# EAGLE design FrontDoorController (EAGLE 6.6.0)
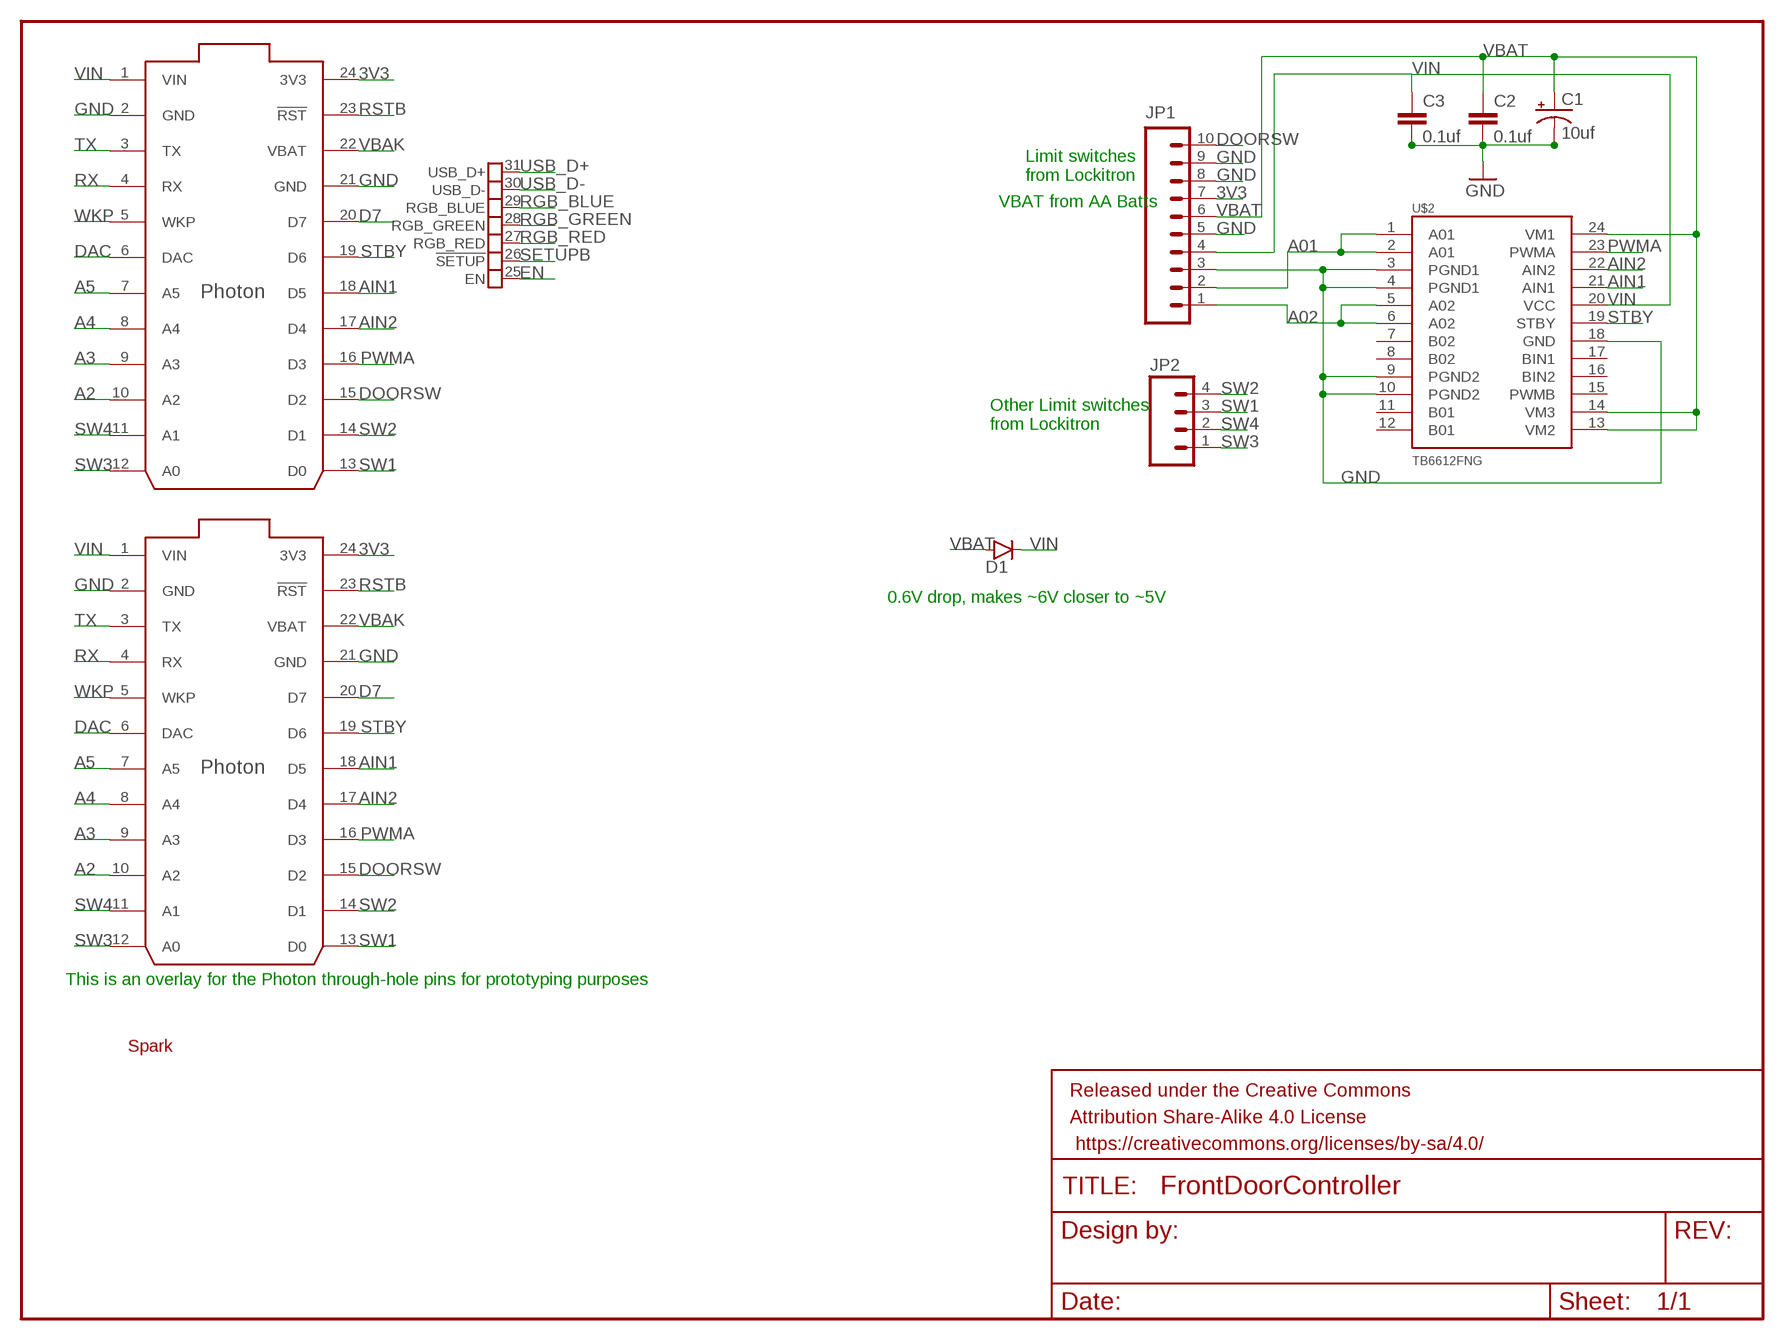
[diagram p0: schematic, sheet 1]

## Parts
C1  10uf  CAP_POL3528  [EIA3528]
C2  0.1uf  CAP0402-CAP  [0402-CAP]
C3  0.1uf  CAP0402-CAP  [0402-CAP]
D1  DIODEPTH  [DIODE-1N4001]
FRAME1  FRAME-LETTER  [CREATIVE_COMMONS]
JP1  M10LOCK  [1X10_LOCK]
JP2  M04LOCK  [1X04_LOCK]
PHOTON  PHOTON_SMD  [PHOTON_SMD]
U$1  SPARK_LOGOLARGE  [SPARK_LOGO]
U$2  TB6612FNG  [SSOP24]
U$3  PHOTON_WITH_HEADERS  [PHOTON]

## Nets
3V3: JP1.7 PHOTON.24(3V3) U$3.24(3V3)
A01: JP1.2 U$2.1(A01) U$2.2(A01)
A2: PHOTON.10(A2) U$3.10(A2)
A02: JP1.1 U$2.5(A02) U$2.6(A02)
A3: PHOTON.9(A3) U$3.9(A3)
A4: PHOTON.8(A4) U$3.8(A4)
A5: PHOTON.7(A5) U$3.7(A5)
AIN1: PHOTON.18(D5) U$2.21(AIN1) U$3.18(D5)
AIN2: PHOTON.17(D4) U$2.22(AIN2) U$3.17(D4)
D7: PHOTON.20(D7) U$3.20(D7)
DAC: PHOTON.6(DAC) U$3.6(DAC)
DOORSW: JP1.10 PHOTON.15(D2) U$3.15(D2)
EN: PHOTON.25(EN)
GND: C1.C(-) C2.2 C3.2 JP1.3 JP1.5 JP1.8 JP1.9 PHOTON.2(GND) PHOTON.21(GND) U$2.3(PGND1) U$2.4(PGND1) U$2.9(PGND2) U$2.10(PGND2) U$2.18(GND) U$3.2(GND) U$3.21(GND)
PWMA: PHOTON.16(D3) U$2.23(PWMA) U$3.16(D3)
RGB_BLUE: PHOTON.29(RGB_BLUE)
RGB_GREEN: PHOTON.28(RGB_GREEN)
RGB_RED: PHOTON.27(RGB_RED)
RSTB: PHOTON.23(!RST) U$3.23(!RST)
RX: PHOTON.4(RX) U$3.4(RX)
SETUPB: PHOTON.26(!SETUP)
STBY: PHOTON.19(D6) U$2.19(STBY) U$3.19(D6)
SW1: JP2.3 PHOTON.13(D0) U$3.13(D0)
SW2: JP2.4 PHOTON.14(D1) U$3.14(D1)
SW3: JP2.1 PHOTON.12(A0) U$3.12(A0)
SW4: JP2.2 PHOTON.11(A1) U$3.11(A1)
TX: PHOTON.3(TX) U$3.3(TX)
USB_D+: PHOTON.31(USB_D+)
USB_D-: PHOTON.30(USB_D-)
VBAK: PHOTON.22(VBAT) U$3.22(VBAT)
VBAT: C1.A(+) C2.1 D1.A JP1.6 U$2.13(VM2) U$2.14(VM3) U$2.24(VM1)
VIN: C3.1 D1.C JP1.4 PHOTON.1(VIN) U$2.20(VCC) U$3.1(VIN)
WKP: PHOTON.5(WKP) U$3.5(WKP)
Unconnected: U$2.7(B02) U$2.8(B02) U$2.11(B01) U$2.12(B01) U$2.15(PWMB) U$2.16(BIN2) U$2.17(BIN1)

## Notes on the sheet
- Limit switches
  from Lockitron
- VBAT from AA Batts
- Other Limit switches
  from Lockitron
- 0.6V drop, makes ~6V closer to ~5V
- This is an overlay for the Photon through-hole pins for prototyping purposes

## Library data of the parts
C1 = SparkFun-Capacitors:CAP_POL: Capacitor Polarized These are standard SMD and PTH capacitors. Normally 10uF, 47uF, and 100uF in electrolytic and tantalum varieties. Always verify the external diameter of the through hole cap, it varies with capacity, voltage, and manufacturer. The EIA devices should be standard.
C2 C3 = SparkFun-Capacitors:CAP: Capacitor Standard 0603 ceramic capacitor, and 0.1" leaded capacitor.
D1 = SparkFun-DiscreteSemi:DIODE: Diode These are standard reverse protection diodes and small signal diodes. SMA package can handle up to about 1A. SOD-323 can handle about 200mA. What the SOD-323 package when ordering, there are some mfgs out there that are 5-pin packages.
FRAME1 = SparkFun-Aesthetics:FRAME-LETTER: Schematic Frame Standard 8.5x11 US Letter frame
JP1 = SparkFun-Connectors:M10: Header 10 Standard 10-pin 0.1" header. Use with straight break away headers (SKU : PRT-00116), right angle break away headers (PRT-00553), swiss pins (PRT-00743), machine pins (PRT-00117), and female headers (PRT-00115).
JP2 = SparkFun-Connectors:M04: Header 4 Standard 4-pin 0.1" header. Use with straight break away headers (SKU : PRT-00116), right angle break away headers (PRT-00553), swiss pins (PRT-00743), machine pins (PRT-00117), and female headers (PRT-00115). Molex polarized connector foot print use with SKU : PRT-08231 with associated crimp pins and housings. 1MM SMD Version SKU: PRT-10208
PHOTON = Spark:PHOTON_SMD: Photon (without headers) - designed to be surface mounted with 7 extra exposed pads on the bottom of the board which include, 3 RGB LED outputs, /SETUP, EN (3.3V SMPS enable input), USB D+ and USB D-.
U$1 = Mikes-Stuff:SPARK_LOGO
U$2 = SparkFun-PowerIC:TB6612FNG: Toshiba 1A dual motor driver IC-09363; PROD_ID: IC-09363
U$3 = Mikes-Stuff:PHOTON

## Board
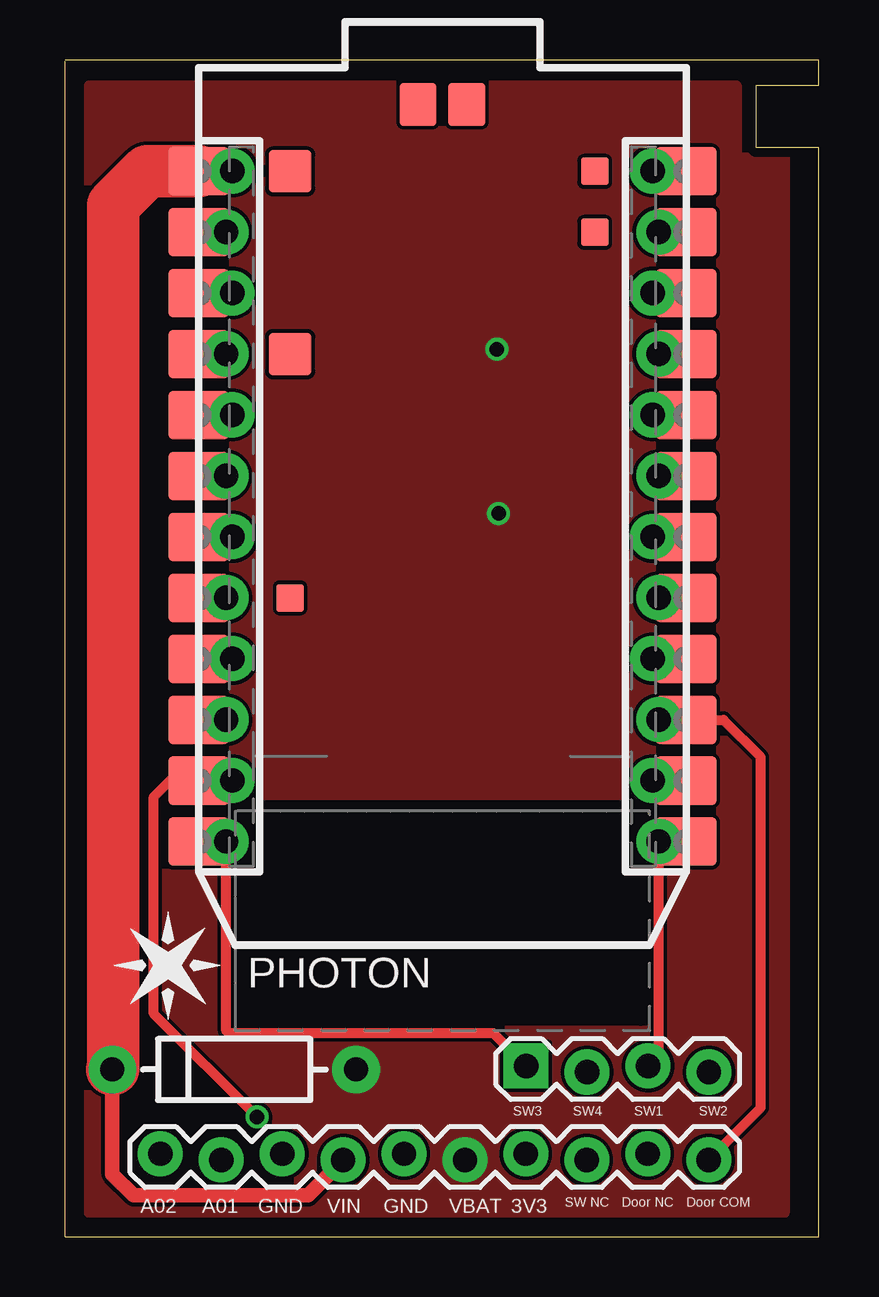
[diagram p1: board, top side]
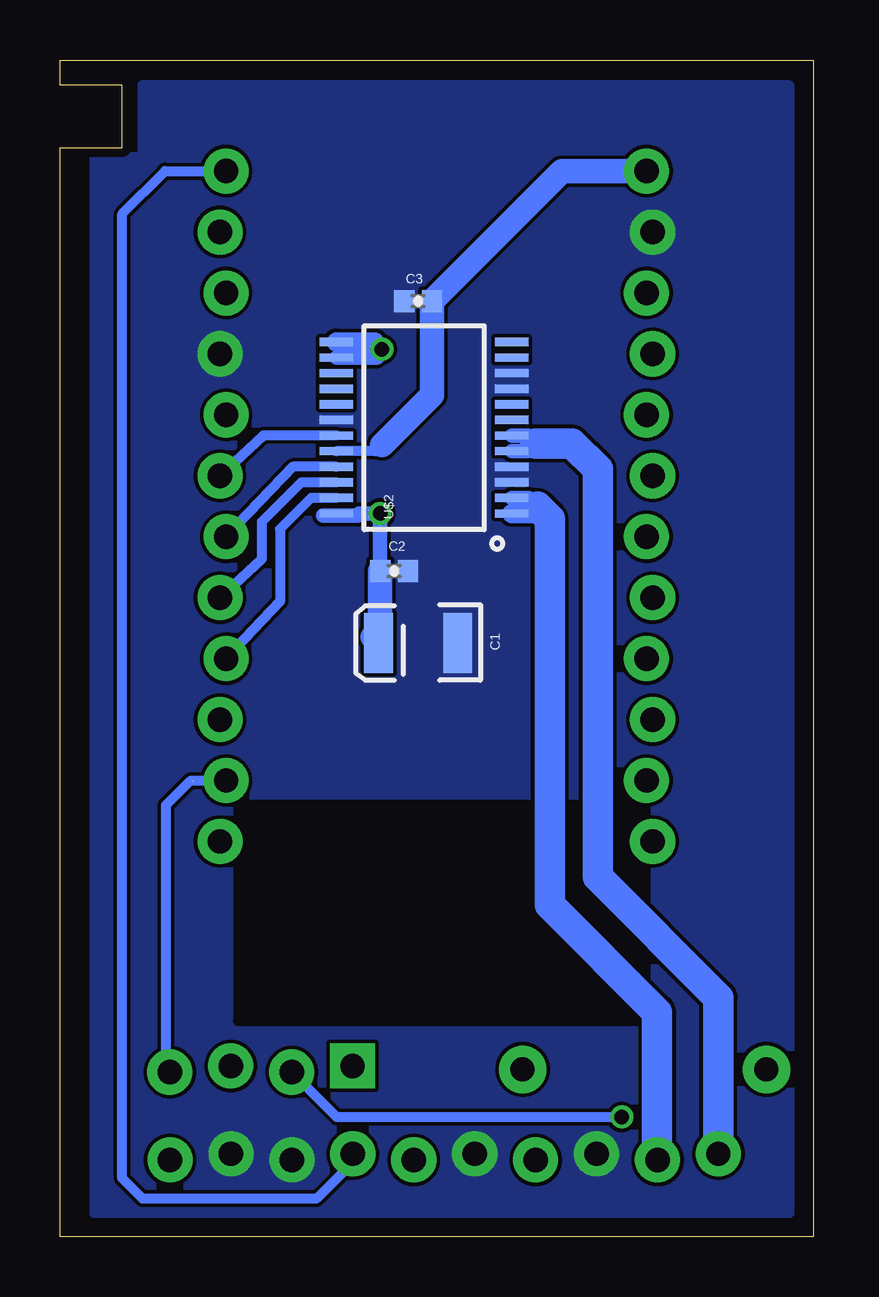
[diagram p2: board, bottom side, seen from below]

Size 31.42 x 49.06 mm. Coordinates in mm from the lower left corner, seen from the top.
Outline: 31.42,49.05 31.42,48 28.82,48 28.82,45.4 31.42,45.4 31.42,0 0,0 0,49
Outline: 31.42,49.05 31.42,49.06
Outline: 31.42,49.05 0,49.06
Copper layers (1*16): Top 0.0356mm / dielectric 1.5011mm / Bottom 0.0356mm
Design rules "LaenPCBOrder": minimum track width 6mil, minimum drill 13mil, track to track 6mil, track to pad 6mil, pad to pad 6mil, via to via 6mil, smd to smd 6mil, copper to edge 15mil, drill to drill 6mil, minimum pad ring 7mil, minimum via ring 7mil, stop-mask expansion 3mil, vias tented up to drill 0mil, thermal gap 10mil

### Footprints (pad centres in the part's own frame; a part is rotated, then mirrored left to right if it is on the bottom)
EIA3528 = smd 1.2 x 2.5: A 1.65,0; C -1.65,0
0402-CAP = smd 0.85 x 0.9: 1 -0.58,0; 2 0.58,0
DIODE-1N4001 = drill 1 pad 1.981: A -5.08,0; C 5.08,0
1X10_LOCK = drill 1.016 pad 1.88: 1 0,0.127; 2 2.54,-0.127; 3 5.08,0.127; 4 7.62,-0.127; 5 10.16,0.127; 6 12.7,-0.127; 7 15.24,0.127; 8 17.78,-0.127; 9 20.32,0.127; 10 22.86,-0.127
1X04_LOCK = drill 1.016 pad 1.88 square: 1 0,0.127 | drill 1.016 pad 1.88: 2 2.54,-0.127; 3 5.08,0.127; 4 7.62,-0.127
PHOTON_SMD = smd 2.54 x 2.032: 1 0,32.258; 2 0,29.718; 3 0,27.178; 4 0,24.638; 5 0,22.098; 6 0,19.558; 7 0,17.018; 8 0,14.478; 9 0,11.938; 10 0,9.398; 11 0,6.858; 12 0,4.318; 13 20.32,4.318; 14 20.32,6.858; 15 20.32,9.398; 16 20.32,11.938; 17 20.32,14.478; 18 20.32,17.018; 19 20.32,19.558; 20 20.32,22.098; 21 20.32,24.638; 22 20.32,27.178; 23 20.32,29.718; 24 20.32,32.258 | smd 1.778 x 1.778: 25 3.81,32.258; 26 3.81,24.638 | smd 1.143 x 1.143: 27 3.81,14.478; 28 16.51,29.718; 29 16.51,32.258 | smd 1.524 x 1.778: 30 11.176,35.052; 31 9.144,35.052
SSOP24 = smd 0.348 x 1.397: 1 -3.575,-3.656; 2 -2.925,-3.656; 3 -2.275,-3.656; 4 -1.625,-3.656; 5 -0.975,-3.656; 6 -0.325,-3.656; 7 0.325,-3.656; 8 0.975,-3.656; 9 1.625,-3.656; 10 2.275,-3.656; 11 2.925,-3.656; 12 3.575,-3.656; 13 3.575,3.656; 14 2.925,3.656; 15 2.275,3.656; 16 1.625,3.656; 17 0.975,3.656; 18 0.325,3.656; 19 -0.325,3.656; 20 -0.975,3.656; 21 -1.625,3.656; 22 -2.275,3.656; 23 -2.925,3.656; 24 -3.575,3.656
PHOTON = drill 1.016 pad 1.88: 1 1.397,32.258; 2 1.143,29.718; 3 1.397,27.178; 4 1.143,24.638; 5 1.397,22.098; 6 1.143,19.558; 7 1.397,17.018; 8 1.143,14.478; 9 1.397,11.938; 10 1.143,9.398; 11 1.397,6.858; 12 1.143,4.318; 13 19.177,4.318; 14 18.923,6.858; 15 19.177,9.398; 16 18.923,11.938; 17 19.177,14.478; 18 18.923,17.018; 19 19.177,19.558; 20 18.923,22.098; 21 19.177,24.638; 22 18.923,27.178; 23 19.177,29.718; 24 18.923,32.258

### Placement (x,y rotation side)
C1  16.49,24.76 180 bottom
C2  17.49,27.76 0 bottom
C3  16.49,39.01 180 bottom
D1  7.05,6.98 180 top
FRAME1  87,34 0 top  (outside the outline)
JP1  3.97,3.34 0 top
JP2  19.22,7 0 top
PHOTON  5.57,12.16 0 top
U$1  2,9 0 top
U$2  16.24,33.73 90 bottom
U$3  5.57,12.17 0 top

### Tracks (layer width: path | path; a pad name or v marks a point on that pad's centre or on a via)
3V3
  Top 1.016: PHOTON.24 24.63,44.42 U$3.24
  Bottom 0.406: JP1.7 19.21,3.12 20.73,1.6 27.98,1.6 28.82,2.44 28.82,42.65 27.04,44.43 U$3.24
A01
  Bottom 0.406: 11.52,30.44 11.8,30.16
  Bottom 0.61: U$2.2 11.88,30.8 11.52,30.44
  Bottom 0.813: 11.8,30.16 U$2.1
  Bottom 1.27: 11.52,30.44 11,29.92 11,13.84 6.53,9.37 6.53,3.23 JP1.2
A2
  Top 1.016: PHOTON.10 6.83,21.56 U$3.10
A02
  Bottom 0.61: U$2.5 11.91,32.76 11.59,33.08 11.91,33.41 U$2.6
  Bottom 1.27: JP1.1 3.97,9.97 9,15 9,32 10.08,33.08 11.59,33.08
A3
  Top 1.016: PHOTON.9 6.83,24.1 U$3.9
A4
  Top 1.016: PHOTON.8 6.83,26.64 U$3.8
A5
  Top 1.016: PHOTON.7 6.83,29.18 U$3.7
AIN1
  Top 1.016: PHOTON.18 24.63,29.18 U$3.18
  Bottom 0.406: U$2.21 21.7,32.1 U$3.18
AIN2
  Top 1.016: U$3.17 PHOTON.17
  Bottom 0.406: U$2.22 21.36,31.45 23.01,29.81 23.01,28.26 U$3.17
D7
  Top 1.016: PHOTON.20 24.63,34.26 U$3.20
DAC
  Top 1.016: PHOTON.6 6.83,31.72 U$3.6
DOORSW
  Top 0.406: JP1.10 29,5.38 29,20 27.44,21.56 PHOTON.15 | PHOTON.15 24.76,21.56 U$3.15 PHOTON.15
  Bottom 0.406: U$3.15 24.5,21.69
GND
  Top 0.406: PHOTON.2 5.59,41.88 5.59,41.89 | 26.01,36.79 PHOTON.21
  Top 1.016: 5.59,41.88 6.83,41.88 U$3.2 | PHOTON.21 24.64,36.79 U$3.21
  pour Bottom (no thermals): 1,48 28,48 28,45 30,45 30,1 1,1
N$3
  cutout Top: 7,18 24,18 24,9 7,9
N$4
  cutout Bottom: 7,18 24,18 24,9 7,9
PWMA
  Top 1.016: U$3.16 PHOTON.16
  Bottom 0.406: U$2.23 20.95,30.8 22.25,29.5 22.25,26.48 U$3.16
RSTB
  Top 1.016: PHOTON.23 24.63,41.88 U$3.23
RX
  Top 1.016: PHOTON.4 6.83,36.8 U$3.4
STBY
  Top 1.016: PHOTON.19 24.63,31.72 U$3.19
  Bottom 0.406: U$2.19 22.94,33.41 U$3.19
SW1
  Top 0.406: PHOTON.13 24.63,16.48 U$3.13 24.75,7.57 JP2.3
  Top 1.016: U$3.13 PHOTON.13
SW2  (1 unrouted)
  Top 1.016: U$3.14 PHOTON.14
  Bottom 0.406: 24.5,19.02 U$3.14 25.97,19.03 27,18 27,7.03 JP2.4
SW3
  Top 0.406: U$3.12 6.71,8.59 6.81,8.49 17.86,8.49 JP2.1
  Top 1.016: PHOTON.12 6.83,16.48 U$3.12
SW4  (via drill 0.6)
  Top 0.406: v8,5 3.7,9.3 3.7,18.35 4.37,19.02 PHOTON.11
  Top 1.016: PHOTON.11 6.83,19.02 U$3.11
  Bottom 0.406: v8,5 19.89,5 JP2.2
TX
  Top 1.016: PHOTON.3 6.83,39.34 U$3.3
VBAK
  Top 1.016: PHOTON.22 24.63,39.34 U$3.22
VBAT  (via drill 0.6)
  Bottom 0.406: C1.A 18.07,24.76 | 18.1,36.69 18.1,36.76 | 20.45,30.07 19.98,30.07 arc-90 U$2.24
  Bottom 0.61: U$2.14 18.34,36.66 | 18.34,36.66 arc-90 v18,37 | 18.34,36.66 18.2,36.66 arc90 18.1,36.76 | C2.1 v18.07,30.16 arc90 v18.07,30.16 18.91,30.16 arc-90 18.99,30.07 20.45,30.07
  Bottom 0.813: U$2.13 18.3,37.3 arc-90 v18,37
  Bottom 1.016: 18.07,24.76 C2.1 | C1.A 18.38,25
  pour Top (no thermals): 1,48 28,48 28,45 30,45 30,1 1,1
VIN
  Top 0.61: D1.C 1.97,2.62 2.86,1.73 10.13,1.73 11.59,3.19 JP1.4
  Top 0.813: 2,7.01 2.01,7
  Top 1.016: PHOTON.1 6.83,44.42 U$3.1
  Top 2.184: PHOTON.1 3.42,44.42 2,43 2,7.01 D1.C
  Bottom 0.406: 18,33 18.25,32.76 U$2.20
  Bottom 1.016: 18,33 15.91,35.09 C3.1 10.49,44.43 U$3.1
WKP
  Top 1.016: PHOTON.5 6.83,34.26 U$3.5

### Text on the board
tPlace: SW3 | SW4 | SW NC | Door NC
tNames: SW1 | SW2 | A02 | A01 | GND | VIN | GND | VBAT | 3V3 | Door COM
Document: Mil | Inch | Inch